# Altium project IPT-LXe.PrjPCB (part 2 of 2)

## Sheet FPGA.SchDoc
size 635 x 381 mm
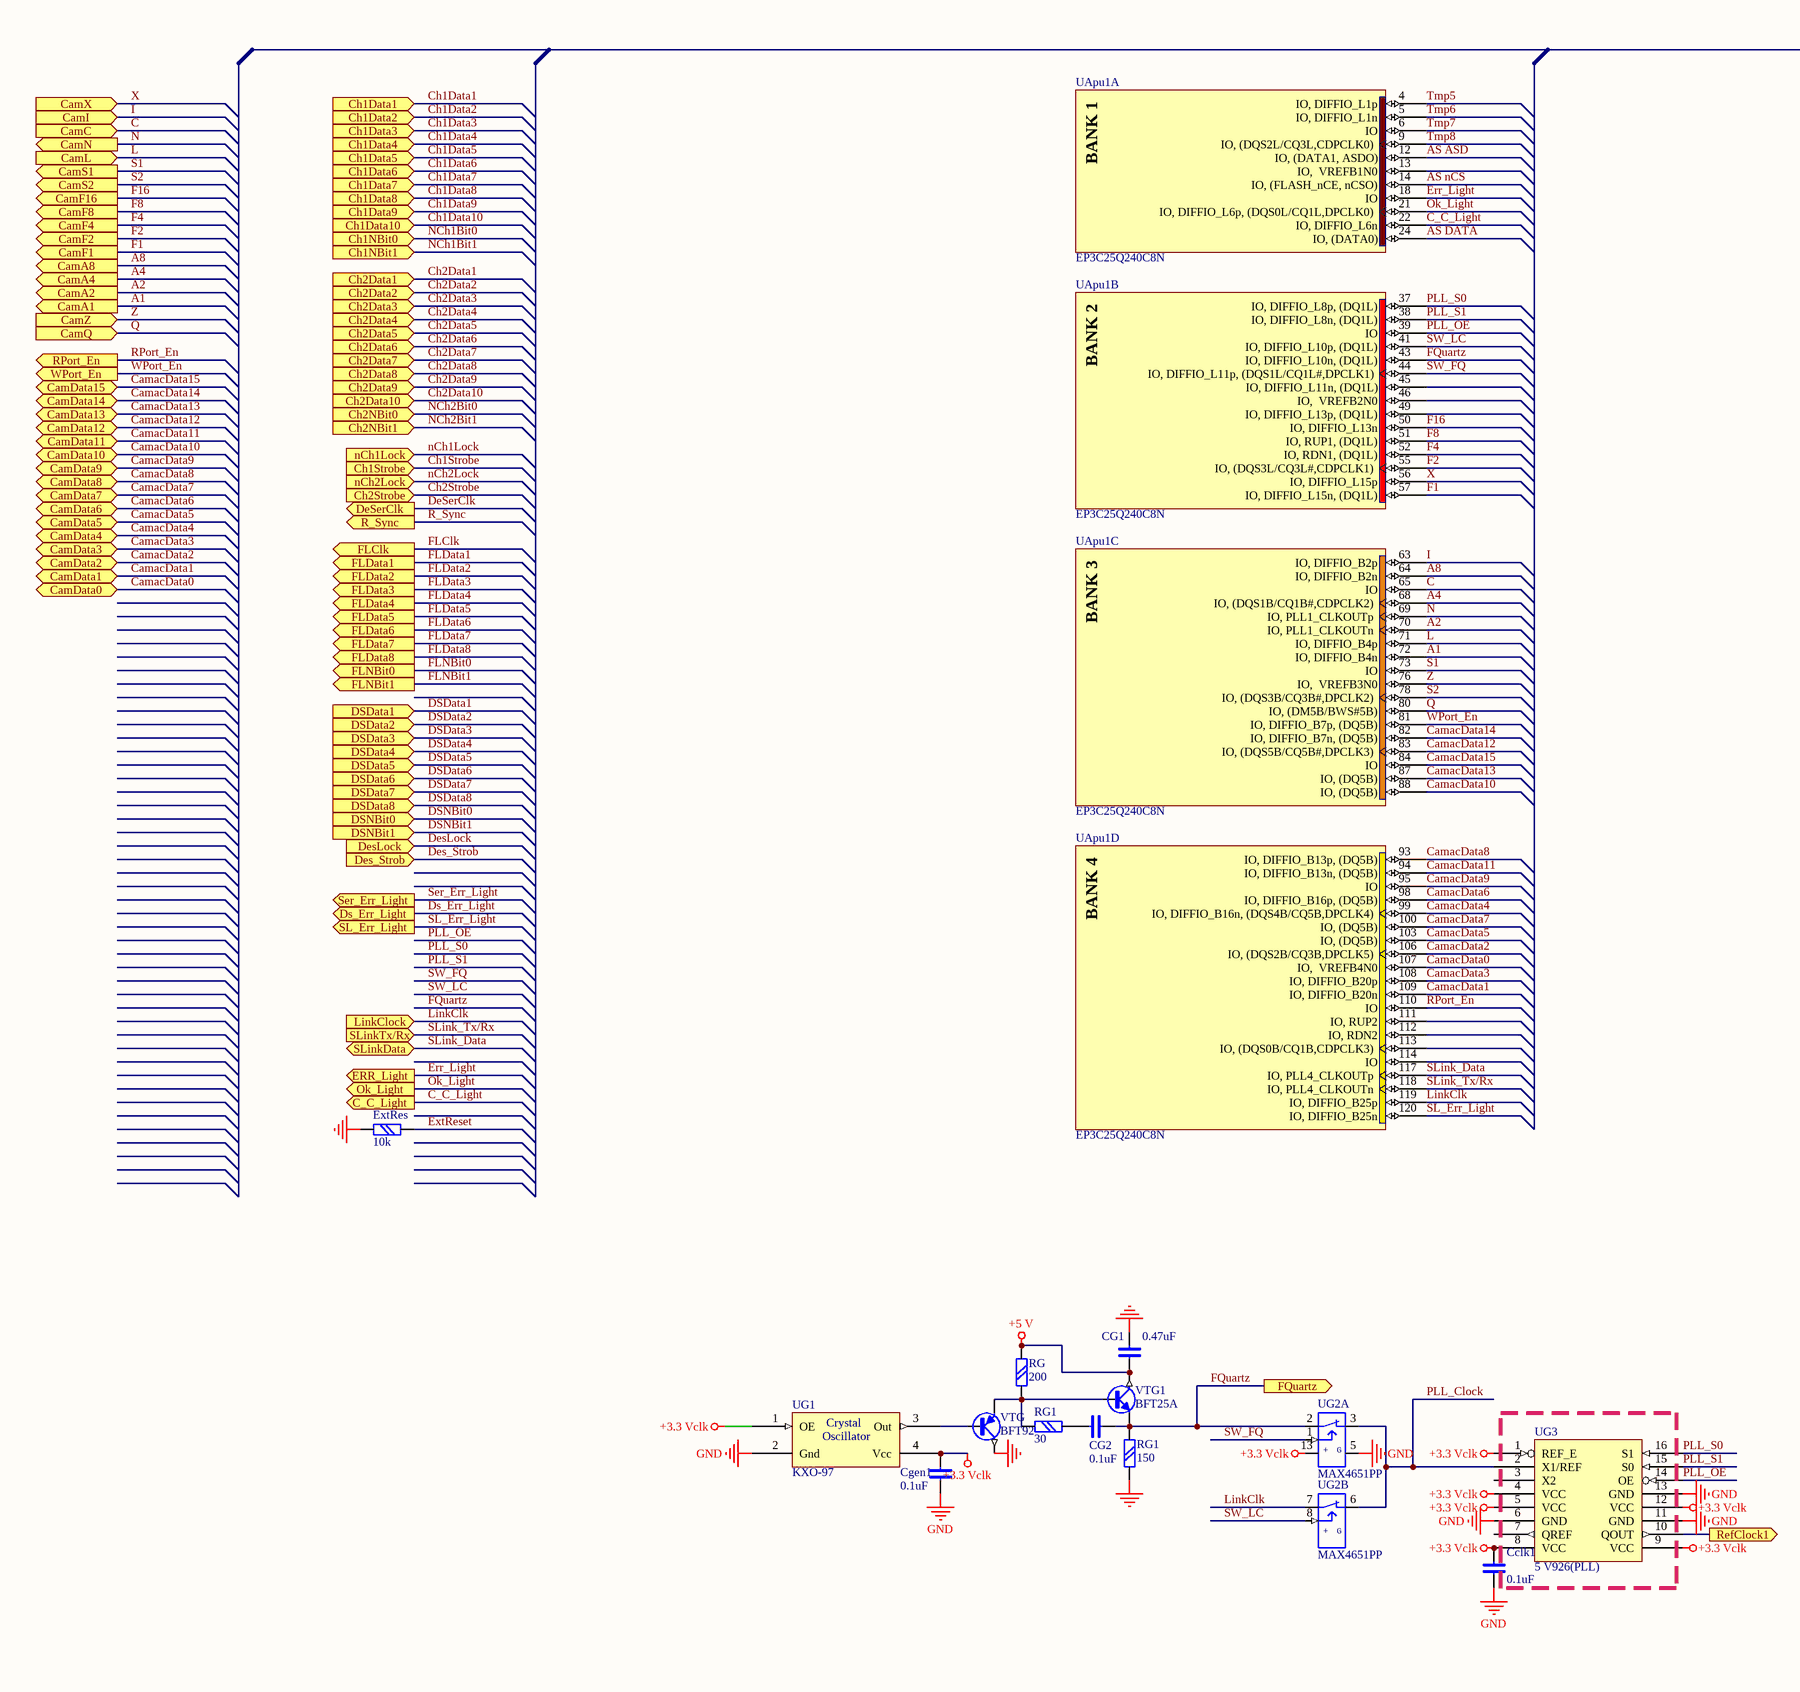
[diagram p5: FPGA.SchDoc, left]
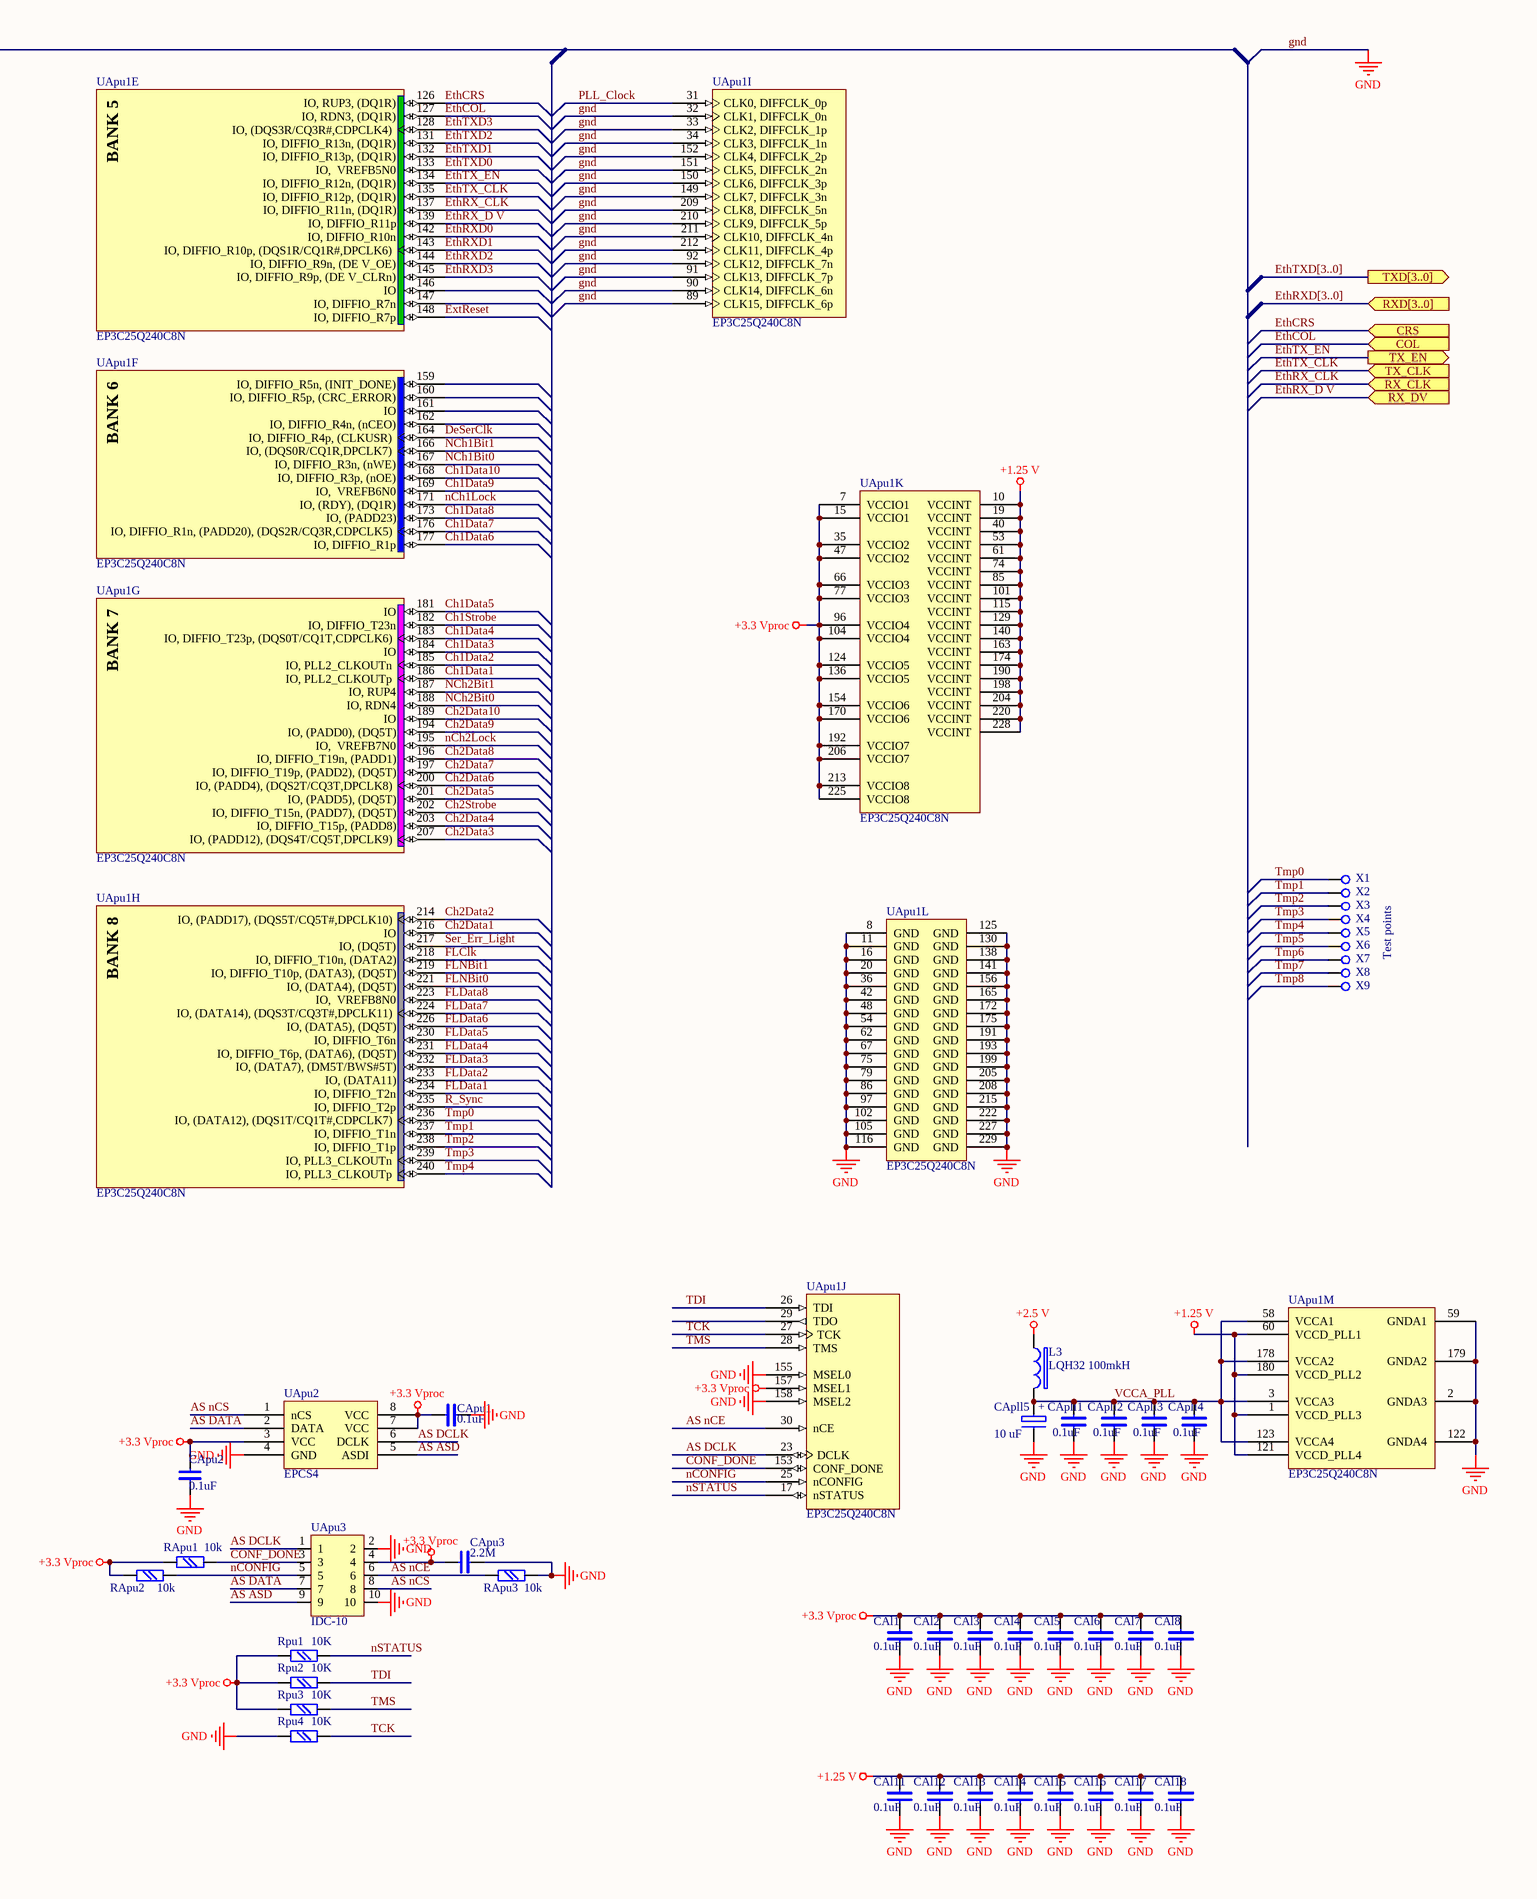
[diagram p6: FPGA.SchDoc, right]

### Parts
(Parts that share a designator on the sheet are numbered #1, #2 ... from top to bottom, then left to right.)
CAl1  0.1uF  [chip0805]
CAl2  0.1uF  [chip0805]
CAl3  0.1uF  [chip0805]
CAl4  0.1uF  [chip0805]
CAl5  0.1uF  [chip0805]
CAl6  0.1uF  [chip0805]
CAl7  0.1uF  [chip0805]
CAl8  0.1uF  [chip0805]
CAl11  0.1uF  [chip0805]
CAl12  0.1uF  [chip0805]
CAl13  0.1uF  [chip0805]
CAl14  0.1uF  [chip0805]
CAl15  0.1uF  [chip0805]
CAl16  0.1uF  [chip0805]
CAl17  0.1uF  [chip0805]
CAl18  0.1uF  [chip0805]
CApll1  0.1uF  [chip0805]
CApll2  0.1uF  [chip0805]
CApll3  0.1uF  [chip0805]
CApll4  0.1uF  [chip0805]
CApll5  10 uF  [CEL-SMD300]
CApu1  0.1uF  [chip0805]
CApu2  0.1uF  [chip0805]
CApu3  2.2M  [chip0805]
Cclk1  0.1uF  [chip0805]
CG1  0.47uF  [chip0805]
CG2  0.1uF  [chip0805]
Cgen1  0.1uF  [chip0805]
ExtRes  10k  [chip0805]
L3  LQH32 100mkH  [SDR0604]
RApu1  10k  [chip0805]
RApu2  10k  [chip0805]
RApu3  10k  [chip0805]
RG  200  [chip0805]
RG1#1  30  [chip0805]
RG1#2  150  [chip0805]
Rpu1  10K  [chip0805]
Rpu2  10K  [chip0805]
Rpu3  10K  [chip0805]
Rpu4  10K  [chip0805]
UApu1  EP3C25Q240C8N  [PQFP240_N]  (parts A,B,C,D,E,F,G,H,I,J,K,L,M of 13)
UApu2  EPCS4  [8SO200]
UApu3  IDC-10  [IDC-10MR]
UG1  KXO-97  [SG-636]
UG2  MAX4651PP  [16SOIC150]  (parts A,B of 4)
UG3  5 V926(PLL)  [TSSOP16]
VTG  BFT92  [SOT23_bt]
VTG1  BFT25A  [SOT23_bt]
X1  Tmp  [DRL06]  (value not drawn)
X2  Tmp  [DRL06]  (value not drawn)
X3  Tmp  [DRL06]  (value not drawn)
X4  Tmp  [DRL06]  (value not drawn)
X5  Tmp  [DRL06]  (value not drawn)
X6  Tmp  [DRL06]  (value not drawn)
X7  Tmp  [DRL06]  (value not drawn)
X8  Tmp  [DRL06]  (value not drawn)
X9  Tmp  [DRL06]  (value not drawn)

### Ports
C_C_Light (out), CamA1 (out), CamA2 (out), CamA4 (out), CamA8 (out), CamC (in), CamData0 (bidir), CamData1 (bidir), CamData2 (bidir), CamData3 (bidir), CamData4 (bidir), CamData5 (bidir), CamData6 (bidir), CamData7 (bidir), CamData8 (bidir), CamData9 (bidir), CamData10 (bidir), CamData11 (bidir), CamData12 (bidir), CamData13 (bidir), CamData14 (bidir), CamData15 (bidir), CamF1 (out), CamF2 (out), CamF4 (out), CamF8 (out), CamF16 (out), CamI (in), CamL (in), CamN (out), CamQ (in), CamS1 (out), CamS2 (out), CamX (in), CamZ (in), Ch1Data1 (in), Ch1Data2 (in), Ch1Data3 (in), Ch1Data4 (in), Ch1Data5 (in), Ch1Data6 (in), Ch1Data7 (in), Ch1Data8 (in), Ch1Data9 (in), Ch1Data10 (in), Ch1NBit0 (in), Ch1NBit1 (in), Ch1Strobe (in), Ch2Data1 (in), Ch2Data2 (in), Ch2Data3 (in), Ch2Data4 (in), Ch2Data5 (in), Ch2Data6 (in), Ch2Data7 (in), Ch2Data8 (in), Ch2Data9 (in), Ch2Data10 (in), Ch2NBit0 (in), Ch2NBit1 (in), Ch2Strobe (in), COL (in), CRS (in), Des_Strob (in), DeSerClk (out), DesLock (in), Ds_Err_Light (out), DSData1 (in), DSData2 (in), DSData3 (in), DSData4 (in), DSData5 (in), DSData6 (in), DSData7 (in), DSData8 (in), DSNBit0 (in), DSNBit1 (in), ERR_Light (out), FLClk (out), FLData1 (out), FLData2 (out), FLData3 (out), FLData4 (out), FLData5 (out), FLData6 (out), FLData7 (out), FLData8 (out), FLNBit0 (out), FLNBit1 (out), FQuartz (out), LinkClock (in), nCh1Lock (in), nCh2Lock (in), Ok_Light (out), R_Sync (out), RefClock1 (out), RPort_En (out), RX_CLK (in), RX_DV (in), RXD[3..0] (in), Ser_Err_Light (out), SL_Err_Light (out), SLinkData (bidir), SLinkTx/Rx (in), TX_CLK (in), TX_EN (out), TXD[3..0] (out), WPort_En (out)

### Nets
+1.25 V: CAl11.2 CAl12.2 CAl13.2 CAl14.2 CAl15.2 CAl16.2 CAl17.2 CAl18.2 UApu1.1(VCCD_PLL3) UApu1.10(VCCINT) UApu1.19(VCCINT) UApu1.40(VCCINT) UApu1.53(VCCINT) UApu1.60(VCCD_PLL1) UApu1.61(VCCINT) UApu1.74(VCCINT) UApu1.85(VCCINT) UApu1.101(VCCINT) UApu1.115(VCCINT) UApu1.121(VCCD_PLL4) UApu1.129(VCCINT) UApu1.140(VCCINT) UApu1.163(VCCINT) UApu1.174(VCCINT) UApu1.180(VCCD_PLL2) UApu1.190(VCCINT) UApu1.198(VCCINT) UApu1.204(VCCINT) UApu1.220(VCCINT) UApu1.228(VCCINT)
+2.5 V: L3.1
+3.3 Vclk: Cclk1.2 Cgen1.2 UG1.1(OE) UG1.4(Vcc) UG2.13(VCC) UG3.1(REF_E) UG3.4(VCC) UG3.5(VCC) UG3.8(VCC) UG3.9(VCC) UG3.12(VCC)
+3.3 Vproc: CAl1.2 CAl2.2 CAl3.2 CAl4.2 CAl5.2 CAl6.2 CAl7.2 CAl8.2 CApu1.2 CApu2.2 CApu3.1 RApu1.1 RApu2.1 Rpu1.1 Rpu2.1 Rpu3.1 UApu1.7(VCCIO1) UApu1.15(VCCIO1) UApu1.35(VCCIO2) UApu1.47(VCCIO2) UApu1.66(VCCIO3) UApu1.77(VCCIO3) UApu1.96(VCCIO4) UApu1.104(VCCIO4) UApu1.124(VCCIO5) UApu1.136(VCCIO5) UApu1.154(VCCIO6) UApu1.157(MSEL1) UApu1.170(VCCIO6) UApu1.192(VCCIO7) UApu1.206(VCCIO7) UApu1.213(VCCIO8) UApu1.225(VCCIO8) UApu2.3(VCC) UApu2.7(VCC) UApu2.8(VCC) UApu3.4
+5 V: CG1.2 RG.2 VTG1.COLL
DGND: CG1.1 ExtRes.1 RG1#2.1 VTG.COLL
gnd: CAl1.1 CAl2.1 CAl3.1 CAl4.1 CAl5.1 CAl6.1 CAl7.1 CAl8.1 CAl11.1 CAl12.1 CAl13.1 CAl14.1 CAl15.1 CAl16.1 CAl17.1 CAl18.1 CApll1.1 CApll2.1 CApll3.1 CApll4.1 CApll5.- CApu1.1 CApu2.1 CApu3.2 Cclk1.1 Cgen1.1 RApu3.2 Rpu4.1 UApu1.2(GNDA3) UApu1.8(GND) UApu1.11(GND) UApu1.16(GND) UApu1.20(GND) UApu1.32(CLK1,_DIFFCLK_0n) UApu1.33(CLK2,_DIFFCLK_1p) UApu1.34(CLK3,_DIFFCLK_1n) UApu1.36(GND) UApu1.42(GND) UApu1.48(GND) UApu1.54(GND) UApu1.59(GNDA1) UApu1.62(GND) UApu1.67(GND) UApu1.75(GND) UApu1.79(GND) UApu1.86(GND) UApu1.89(CLK15,_DIFFCLK_6p) UApu1.90(CLK14,_DIFFCLK_6n) UApu1.91(CLK13,_DIFFCLK_7p) UApu1.92(CLK12,_DIFFCLK_7n) UApu1.97(GND) UApu1.102(GND) UApu1.105(GND) UApu1.116(GND) UApu1.122(GNDA4) UApu1.125(GND) UApu1.130(GND) UApu1.138(GND) UApu1.141(GND) UApu1.149(CLK7,_DIFFCLK_3n) UApu1.150(CLK6,_DIFFCLK_3p) UApu1.151(CLK5,_DIFFCLK_2n) UApu1.152(CLK4,_DIFFCLK_2p) UApu1.155(MSEL0) UApu1.156(GND) UApu1.158(MSEL2) UApu1.165(GND) UApu1.172(GND) UApu1.175(GND) UApu1.179(GNDA2) UApu1.191(GND) UApu1.193(GND) UApu1.199(GND) UApu1.205(GND) UApu1.208(GND) UApu1.209(CLK8,_DIFFCLK_5n) UApu1.210(CLK9,_DIFFCLK_5p) UApu1.211(CLK10,_DIFFCLK_4n) UApu1.212(CLK11,_DIFFCLK_4p) UApu1.215(GND) UApu1.222(GND) UApu1.227(GND) UApu1.229(GND) UApu2.4(GND) UApu3.2 UApu3.10 UG1.2(Gnd) UG2.5(GND) UG3.6(GND) UG3.11(GND) UG3.13(GND)
A1: UApu1.72(IO,_DIFFIO_B4n) ; port CamA1
A2: UApu1.70(IO,_PLL1_CLKOUTn) ; port CamA2
A4: UApu1.68(IO,_(DQS1B/CQ1B#,CDPCLK2)) ; port CamA4
A8: UApu1.64(IO,_DIFFIO_B2n) ; port CamA8
AS ASD: UApu1.12(IO,_(DATA1,_ASDO)) UApu2.5(ASDI) UApu3.9
AS DATA: UApu1.24(IO,_(DATA0)) UApu2.2(DATA) UApu3.7
AS DCLK: UApu1.23(DCLK) UApu2.6(DCLK) UApu3.1
AS nCE: RApu3.1 UApu1.30(nCE) UApu3.6
AS nCS: UApu1.14(IO,_(FLASH_nCE,_nCSO)) UApu2.1(nCS) UApu3.8
C: UApu1.65(IO) ; port CamC
C_C_Light: UApu1.22(IO,_DIFFIO_L6n) ; port C_C_Light
CamacData0: UApu1.107(IO,__VREFB4N0) ; port CamData0  [project net Cam_Data0]
CamacData1: UApu1.109(IO,_DIFFIO_B20n) ; port CamData1  [project net Cam_Data1]
CamacData2: UApu1.106(IO,_(DQS2B/CQ3B,DPCLK5)) ; port CamData2  [project net Cam_Data2]
CamacData3: UApu1.108(IO,_DIFFIO_B20p) ; port CamData3  [project net Cam_Data3]
CamacData4: UApu1.99(IO,_DIFFIO_B16n,_(DQS4B/CQ5B,DPCLK4)) ; port CamData4  [project net Cam_Data4]
CamacData5: UApu1.103(IO,_(DQ5B)) ; port CamData5  [project net Cam_Data5]
CamacData6: UApu1.98(IO,_DIFFIO_B16p,_(DQ5B)) ; port CamData6  [project net Cam_Data6]
CamacData7: UApu1.100(IO,_(DQ5B)) ; port CamData7  [project net Cam_Data7]
CamacData8: UApu1.93(IO,_DIFFIO_B13p,_(DQ5B)) ; port CamData8  [project net Cam_Data8]
CamacData9: UApu1.95(IO) ; port CamData9  [project net Cam_Data9]
CamacData10: UApu1.88(IO,_(DQ5B)) ; port CamData10  [project net Cam_Data10]
CamacData11: UApu1.94(IO,_DIFFIO_B13n,_(DQ5B)) ; port CamData11  [project net Cam_Data11]
CamacData12: UApu1.83(IO,_(DQS5B/CQ5B#,DPCLK3)) ; port CamData12  [project net Cam_Data12]
CamacData13: UApu1.87(IO,_(DQ5B)) ; port CamData13  [project net Cam_Data13]
CamacData14: UApu1.82(IO,_DIFFIO_B7n,_(DQ5B)) ; port CamData14  [project net Cam_Data14]
CamacData15: UApu1.84(IO) ; port CamData15  [project net Cam_Data15]
Ch1Data1: UApu1.186(IO,_PLL2_CLKOUTp) ; port Ch1Data1
Ch1Data2: UApu1.185(IO,_PLL2_CLKOUTn) ; port Ch1Data2
Ch1Data3: UApu1.184(IO) ; port Ch1Data3
Ch1Data4: UApu1.183(IO,_DIFFIO_T23p,_(DQS0T/CQ1T,CDPCLK6)) ; port Ch1Data4
Ch1Data5: UApu1.181(IO) ; port Ch1Data5
Ch1Data6: UApu1.177(IO,_DIFFIO_R1p) ; port Ch1Data6
Ch1Data7: UApu1.176(IO,_DIFFIO_R1n,_(PADD20),_(DQS2R/CQ3R,CDPCLK5)) ; port Ch1Data7
Ch1Data8: UApu1.173(IO,_(PADD23)) ; port Ch1Data8
Ch1Data9: UApu1.169(IO,__VREFB6N0) ; port Ch1Data9
Ch1Data10: UApu1.168(IO,_DIFFIO_R3p,_(nOE)) ; port Ch1Data10
Ch1Strobe: UApu1.182(IO,_DIFFIO_T23n) ; port Ch1Strobe
Ch2Data1: UApu1.216(IO) ; port Ch2Data1
Ch2Data2: UApu1.214(IO,_(PADD17),_(DQS5T/CQ5T#,DPCLK10)) ; port Ch2Data2
Ch2Data3: UApu1.207(IO,_(PADD12),_(DQS4T/CQ5T,DPCLK9)) ; port Ch2Data3
Ch2Data4: UApu1.203(IO,_DIFFIO_T15p,_(PADD8)) ; port Ch2Data4
Ch2Data5: UApu1.201(IO,_(PADD5),_(DQ5T)) ; port Ch2Data5
Ch2Data6: UApu1.200(IO,_(PADD4),_(DQS2T/CQ3T,DPCLK8)) ; port Ch2Data6
Ch2Data7: UApu1.197(IO,_DIFFIO_T19p,_(PADD2),_(DQ5T)) ; port Ch2Data7
Ch2Data8: UApu1.196(IO,_DIFFIO_T19n,_(PADD1)) ; port Ch2Data8
Ch2Data9: UApu1.194(IO,_(PADD0),_(DQ5T)) ; port Ch2Data9
Ch2Data10: UApu1.189(IO) ; port Ch2Data10
Ch2Strobe: UApu1.202(IO,_DIFFIO_T15n,_(PADD7),_(DQ5T)) ; port Ch2Strobe
CONF_DONE: RApu1.2 UApu1.153(CONF_DONE) UApu3.3
DeSerClk: UApu1.164(IO,_DIFFIO_R4p,_(CLKUSR)) ; port DeSerClk
ERR_Light: UApu1.18(IO) ; port ERR_Light
EthCOL: UApu1.127(IO,_RDN3,_(DQ1R)) ; port COL  [project net COL]
EthCRS: UApu1.126(IO,_RUP3,_(DQ1R)) ; port CRS  [project net CRS]
EthRX_CLK: UApu1.137(IO,_DIFFIO_R11n,_(DQ1R)) ; port RX_CLK
EthRX_D V: UApu1.139(IO,_DIFFIO_R11p) ; port RX_DV
EthRXD0: UApu1.142(IO,_DIFFIO_R10n)
EthRXD1: UApu1.143(IO,_DIFFIO_R10p,_(DQS1R/CQ1R#,DPCLK6))
EthRXD2: UApu1.144(IO,_DIFFIO_R9n,_(DE_V_OE))
EthRXD3: UApu1.145(IO,_DIFFIO_R9p,_(DE_V_CLRn))
EthTX_CLK: UApu1.135(IO,_DIFFIO_R12p,_(DQ1R)) ; port TX_CLK
EthTX_EN: UApu1.134(IO,_DIFFIO_R12n,_(DQ1R)) ; port TX_EN
EthTXD0: UApu1.133(IO,__VREFB5N0)
EthTXD1: UApu1.132(IO,_DIFFIO_R13p,_(DQ1R))
EthTXD2: UApu1.131(IO,_DIFFIO_R13n,_(DQ1R))
EthTXD3: UApu1.128(IO,_(DQS3R/CQ3R#,CDPCLK4))
ExtReset: ExtRes.2 UApu1.148(IO,_DIFFIO_R7p)
F1: UApu1.57(IO,_DIFFIO_L15n,_(DQ1L)) ; port CamF1  [project net CamF1]
F2: UApu1.55(IO,_(DQS3L/CQ3L#,CDPCLK1)) ; port CamF2  [project net CamF2]
F4: UApu1.52(IO,_RDN1,_(DQ1L)) ; port CamF4  [project net CamF4]
F8: UApu1.51(IO,_RUP1,_(DQ1L)) ; port CamF8  [project net CamF8]
F16: UApu1.50(IO,_DIFFIO_L13n) ; port CamF16  [project net CamF16]
FLClk: UApu1.218(IO,_DIFFIO_T10n,_(DATA2)) ; port FLClk
FLData1: UApu1.234(IO,_DIFFIO_T2n) ; port FLData1
FLData2: UApu1.233(IO,_(DATA11)) ; port FLData2
FLData3: UApu1.232(IO,_(DATA7),_(DM5T/BWS#5T)) ; port FLData3
FLData4: UApu1.231(IO,_DIFFIO_T6p,_(DATA6),_(DQ5T)) ; port FLData4
FLData5: UApu1.230(IO,_DIFFIO_T6n) ; port FLData5
FLData6: UApu1.226(IO,_(DATA5),_(DQ5T)) ; port FLData6
FLData7: UApu1.224(IO,_(DATA14),_(DQS3T/CQ3T#,DPCLK11)) ; port FLData7
FLData8: UApu1.223(IO,__VREFB8N0) ; port FLData8
FLNBit0: UApu1.221(IO,_(DATA4),_(DQ5T)) ; port FLNBit0
FLNBit1: UApu1.219(IO,_DIFFIO_T10p,_(DATA3),_(DQ5T)) ; port FLNBit1
FQuartz: CG2.1 RG1#2.2 UApu1.43(IO,_DIFFIO_L10n,_(DQ1L)) UG2.2(IN) VTG1.EMIT ; port FQuartz
I: UApu1.63(IO,_DIFFIO_B2p) ; port CamI  [project net CamI]
L: UApu1.71(IO,_DIFFIO_B4p) ; port CamL  [project net CamL]
LinkClk: UApu1.119(IO,_DIFFIO_B25p) UG2.7(IN) ; port LinkClock
N: UApu1.69(IO,_PLL1_CLKOUTp) ; port CamN  [project net CamN]
NCh1Bit0: UApu1.167(IO,_DIFFIO_R3n,_(nWE)) ; port Ch1NBit0  [project net Ch1Data11]
NCh1Bit1: UApu1.166(IO,_(DQS0R/CQ1R,DPCLK7)) ; port Ch1NBit1  [project net Ch1Data12]
nCh1Lock: UApu1.171(IO,_(RDY),_(DQ1R)) ; port nCh1Lock
NCh2Bit0: UApu1.188(IO,_RDN4) ; port Ch2NBit0  [project net Ch2Data11]
NCh2Bit1: UApu1.187(IO,_RUP4) ; port Ch2NBit1  [project net Ch2Data12]
nCh2Lock: UApu1.195(IO,__VREFB7N0) ; port nCh2Lock
nCONFIG: RApu2.2 UApu1.25(nCONFIG) UApu3.5
nSTATUS: Rpu1.2 UApu1.17(nSTATUS)
Ok_Light: UApu1.21(IO,_DIFFIO_L6p,_(DQS0L/CQ1L,DPCLK0)) ; port Ok_Light
PLL_Clock: UApu1.31(CLK0,_DIFFCLK_0p) UG2.3(OUT) UG2.6(OUT) UG3.2(X1/REF)
PLL_OE: UApu1.39(IO) UG3.14(OE)
PLL_S0: UApu1.37(IO,_DIFFIO_L8p,_(DQ1L)) UG3.16(S1)
PLL_S1: UApu1.38(IO,_DIFFIO_L8n,_(DQ1L)) UG3.15(S0)
Q: UApu1.80(IO,_(DM5B/BWS#5B)) ; port CamQ  [project net CamQ]
R_Sync: UApu1.235(IO,_DIFFIO_T2p) ; port R_Sync
RefClock1: UG3.10(QOUT) ; port RefClock1
RPort_En: UApu1.110(IO) ; port RPort_En
S1: UApu1.73(IO) ; port CamS1  [project net CamS1]
S2: UApu1.78(IO,_(DQS3B/CQ3B#,DPCLK2)) ; port CamS2  [project net CamS2]
Ser_Err_Light: UApu1.217(IO,_(DQ5T)) ; port Ser_Err_Light
SL_Err_Light: UApu1.120(IO,_DIFFIO_B25n) ; port SL_Err_Light
SLink_Data: UApu1.117(IO,_PLL4_CLKOUTp) ; port SLinkData
SLink_Tx/Rx: UApu1.118(IO,_PLL4_CLKOUTn) ; port SLinkTx/Rx
SW_FQ: UApu1.44(IO,_DIFFIO_L11p,_(DQS1L/CQ1L#,DPCLK1)) UG2.1(CONTROL)
SW_LC: UApu1.41(IO,_DIFFIO_L10p,_(DQ1L)) UG2.8(CONTROL)
TCK: Rpu4.2 UApu1.27(TCK)
TDI: Rpu2.2 UApu1.26(TDI)
Tmp0: UApu1.236(IO,_(DATA12),_(DQS1T/CQ1T#,CDPCLK7)) X1.DRIL
Tmp1: UApu1.237(IO,_DIFFIO_T1n) X2.DRIL
Tmp2: UApu1.238(IO,_DIFFIO_T1p) X3.DRIL
Tmp3: UApu1.239(IO,_PLL3_CLKOUTn) X4.DRIL
Tmp4: UApu1.240(IO,_PLL3_CLKOUTp) X5.DRIL
Tmp5: UApu1.4(IO,_DIFFIO_L1p) X6.DRIL
Tmp6: UApu1.5(IO,_DIFFIO_L1n) X7.DRIL
Tmp7: UApu1.6(IO) X8.DRIL
Tmp8: UApu1.9(IO,_(DQS2L/CQ3L,CDPCLK0)) X9.DRIL
TMS: Rpu3.2 UApu1.28(TMS)
VCCA_PLL: CApll1.2 CApll2.2 CApll3.2 CApll4.2 CApll5.+ L3.2 UApu1.3(VCCA3) UApu1.58(VCCA1) UApu1.123(VCCA4) UApu1.178(VCCA2)
WPort_En: UApu1.81(IO,_DIFFIO_B7p,_(DQ5B)) ; port WPort_En
X: UApu1.56(IO,_DIFFIO_L15p) ; port CamX  [project net CamX]
Z: UApu1.76(IO,__VREFB3N0) ; port CamZ  [project net CamZ]
NetCG2_2: CG2.2 RG1#1.1
NetRG_1: RG.1 RG1#1.2 VTG.EMIT VTG1.BASE
NetUG1_3: UG1.3(Out) VTG.BASE

Not connected (* = marked no-connect by the designer): UApu1 13(IO,__VREFB1N0) 29(TDO) 45(IO,_DIFFIO_L11n,_(DQ1L)) 46(IO,__VREFB2N0) 49(IO,_DIFFIO_L13p,_(DQ1L)) 111(IO,_RUP2) 112(IO,_RDN2) 113(IO,_(DQS0B/CQ1B,CDPCLK3)) 114(IO) 146(IO) 147(IO,_DIFFIO_R7n) 159(IO,_DIFFIO_R5n,_(INIT_DONE)) 160(IO,_DIFFIO_R5p,_(CRC_ERROR)) 161(IO) 162(IO,_DIFFIO_R4n,_(nCEO)); UG3 3(X2) 7(QREF)

### Buses and harness runs
bus EthRXD[3..0] = port RXD[3..0]
bus EthTXD[3..0] = port TXD[3..0]

### Notes on the sheet
- Test points
- (in symbol EP3C25Q240C8N, part A) BANK 1
- (in symbol EP3C25Q240C8N, part B) BANK 2
- (in symbol EP3C25Q240C8N, part C) BANK 3
- (in symbol EP3C25Q240C8N, part D) BANK 4
- (in symbol EP3C25Q240C8N, part E) BANK 5
- (in symbol EP3C25Q240C8N, part F) BANK 6
- (in symbol EP3C25Q240C8N, part G) BANK 7
- (in symbol EP3C25Q240C8N, part H) BANK 8
- (in symbol MAX4651PP, part A) +; G
- (in symbol MAX4651PP, part B) +; G
- (in symbol SG-636) Crystal; Oscillator

### Library data of the parts
CAl1-CAl8 CAl11-CAl18 CApll1-CApll4 = C
CApll5 = C POL
CApu1-CApu3 Cclk1 CG1 CG2 Cgen1 = C: Text Field1: 20; Text Field2: 10
ExtRes RG RG1#1 RG1#2 = MLT: Text Field1: 20; Text Field2: 20
L3 = DR: Text Field1: 30; Text Field2: 10
RApu1-RApu3 Rpu1-Rpu4 = R: Text Field1: 20; Text Field2: 20
UApu1 = EP3C25Q240C8N: Cyclone III Family FPGA, 148 I/O Pins, 4 PLLs, 240-Pin PQFP, Speed Grade 8, Commercial Grade, Pb-Free; Published: 26-Feb-2007; DatasheetVersion: ver2.0, May-2008; PackageVersion: ver15.1, May-2008; PackageReference: PQFP240; Publisher: Altium Limited; PackageDescription: 240-Pin Plastic Quad Flat Pack (PQFP240) - Wire Bond; Code_JEDEC: MS-029-GA; ComponentLink1Description: Manufacturer Link; ComponentLink1URL: http://www.altera.com/; ComponentLink2Description: Handbook (7.86MB); ComponentLink2URL: http://www.altera.com/literature/hb/cyc3/cyclone3_handbook.pdf; ComponentLink3Description: Packaging Specification; ComponentLink3URL: http://www.altera.com/literature/ds/dspkg.pdf
UApu2 = EPCS1: Serial configuration device for Cyclone (Altera)
UApu3 = IDC-10: Text Field1: 40; Text Field2: 60
UG1 = SG-636: Crystal Oscillator (SMD)
UG2 = MAX4651PP: Text Field1: 20; Text Field2: 40
UG3 = 5V926(PLL)
VTG = $PNP: Text Field1: 10; Text Field2: 20
VTG1 = $NPN: Text Field1: 10; Text Field2: 20
X1-X9 = DRL

## Nets that join several sheets
+1.25 V: Ref&Supply Unit (Csup16.+ Csup17.1 Uref6.2 Uref6.4), FPGA (30 pins)
+2.5 V: Ref&Supply Unit (Csup13.+ Csup14.1 Uref5.2 Uref5.4), FPGA (L3.1)
+3.3 V: Ref&Supply Unit (Csup7.+ Csup8.1 Uref3.2 Uref3.4), In-Out (21 pins), IPT-LXe Top (43 pins)
+3.3 Vclk: Ref&Supply Unit (Csup10.+ Csup11.1 Uref4.2 Uref4.4), FPGA (11 pins)
+3.3 Vproc: Ref&Supply Unit (Csup4.+ Csup5.1 Uref2.2 Uref2.4), FPGA (37 pins)
+5 V: Main schem (CLED.1 VDLED6.ANOD VDLED7.ANOD VDLED8.ANOD), Ref&Supply Unit (Csup2.+ Csup18.1 Uref1.2 Uref1.4), In-Out (9 pins), IPT-LXe Top (C9.2 VDLED1.ANOD VDLED2.ANOD), FPGA (CG1.2 RG.2 VTG1.COLL)
+6V Sup: Ref&Supply Unit (10 pins), CAMAC_v2 (7 pins)
Cam +6v: Ref&Supply Unit (L2.1), CAMAC_v2 (J1.B42 L1.1)
gnd: Main schem (CLED.2 CLED1.2 CLED2.2 CLED3.2), Ref&Supply Unit (26 pins), In-Out (36 pins), CAMAC_v2 (16 pins), IPT-LXe Top (59 pins), FPGA (91 pins)
A1: CAMAC_v2 (Rc14.2), FPGA (UApu1.72)
A2: CAMAC_v2 (Rc12.2), FPGA (UApu1.70)
A4: CAMAC_v2 (Rc10.2), FPGA (UApu1.68)
A8: CAMAC_v2 (Rc8.2), FPGA (UApu1.64)
C: CAMAC_v2 (Rc9.1), FPGA (UApu1.65)
C_C_Light: Main schem (RLED1.2), FPGA (UApu1.22)
Cam_Data0: CAMAC_v2 (Ucam1.9 Ucam3.10), FPGA (UApu1.107)
Cam_Data1: CAMAC_v2 (Ucam2.9 Ucam4.10), FPGA (UApu1.109)
Cam_Data2: CAMAC_v2 (Ucam1.12 Ucam3.5), FPGA (UApu1.106)
Cam_Data3: CAMAC_v2 (Ucam2.12 Ucam4.5), FPGA (UApu1.108)
Cam_Data4: CAMAC_v2 (Ucam1.7 Ucam3.13), FPGA (UApu1.99)
Cam_Data5: CAMAC_v2 (Ucam2.7 Ucam4.13), FPGA (UApu1.103)
Cam_Data6: CAMAC_v2 (Ucam1.14 Ucam3.2), FPGA (UApu1.98)
Cam_Data7: CAMAC_v2 (Ucam2.14 Ucam4.2), FPGA (UApu1.100)
Cam_Data8: CAMAC_v2 (Ucam1.5 Ucam5.10), FPGA (UApu1.93)
Cam_Data9: CAMAC_v2 (Ucam2.5 Ucam6.10), FPGA (UApu1.95)
Cam_Data10: CAMAC_v2 (Ucam1.16 Ucam5.5), FPGA (UApu1.88)
Cam_Data11: CAMAC_v2 (Ucam2.16 Ucam6.5), FPGA (UApu1.94)
Cam_Data12: CAMAC_v2 (Ucam1.3 Ucam5.13), FPGA (UApu1.83)
Cam_Data13: CAMAC_v2 (Ucam2.3 Ucam6.13), FPGA (UApu1.87)
Cam_Data14: CAMAC_v2 (Ucam1.18 Ucam5.2), FPGA (UApu1.82)
Cam_Data15: CAMAC_v2 (Ucam2.18 Ucam6.2), FPGA (UApu1.84)
CamF1: CAMAC_v2 (Rc6.2), FPGA (UApu1.57)
CamF2: CAMAC_v2 (Rc4.2), FPGA (UApu1.55)
CamF4: CAMAC_v2 (Rc3.2), FPGA (UApu1.52)
CamF8: CAMAC_v2 (Rc2.2), FPGA (UApu1.51)
CamF16: CAMAC_v2 (Rc1.2), FPGA (UApu1.50)
CamI: CAMAC_v2 (Rc7.1), FPGA (UApu1.63)
CamL: CAMAC_v2 (Rc13.1), FPGA (UApu1.71)
CamN: CAMAC_v2 (Rc11.1), FPGA (UApu1.69)
CamQ: CAMAC_v2 (Rc18.2), FPGA (UApu1.80)
CamS1: CAMAC_v2 (Rc15.1), FPGA (UApu1.73)
CamS2: CAMAC_v2 (Rc17.1), FPGA (UApu1.78)
CamX: CAMAC_v2 (Rc5.1), FPGA (UApu1.56)
CamZ: CAMAC_v2 (Rc16.2), FPGA (UApu1.76)
Ch1Data1: IPT-LXe Top (UFL1.45), FPGA (UApu1.186)
Ch1Data2: IPT-LXe Top (UFL1.46), FPGA (UApu1.185)
Ch1Data3: IPT-LXe Top (UFL1.47), FPGA (UApu1.184)
Ch1Data4: IPT-LXe Top (UFL1.48), FPGA (UApu1.183)
Ch1Data5: IPT-LXe Top (UFL1.54), FPGA (UApu1.181)
Ch1Data6: IPT-LXe Top (UFL1.55), FPGA (UApu1.177)
Ch1Data7: IPT-LXe Top (UFL1.56), FPGA (UApu1.176)
Ch1Data8: IPT-LXe Top (UFL1.57), FPGA (UApu1.173)
Ch1Data9: IPT-LXe Top (UFL1.64), FPGA (UApu1.169)
Ch1Data10: IPT-LXe Top (UFL1.65), FPGA (UApu1.168)
Ch1Data11: IPT-LXe Top (UFL1.66), FPGA (UApu1.167)
Ch1Data12: IPT-LXe Top (UFL1.67), FPGA (UApu1.166)
Ch1Strobe: IPT-LXe Top (UFL1.49), FPGA (UApu1.182)
Ch2Data1: IPT-LXe Top (UFL2.45), FPGA (UApu1.216)
Ch2Data2: IPT-LXe Top (UFL2.46), FPGA (UApu1.214)
Ch2Data3: IPT-LXe Top (UFL2.47), FPGA (UApu1.207)
Ch2Data4: IPT-LXe Top (UFL2.48), FPGA (UApu1.203)
Ch2Data5: IPT-LXe Top (UFL2.54), FPGA (UApu1.201)
Ch2Data6: IPT-LXe Top (UFL2.55), FPGA (UApu1.200)
Ch2Data7: IPT-LXe Top (UFL2.56), FPGA (UApu1.197)
Ch2Data8: IPT-LXe Top (UFL2.57), FPGA (UApu1.196)
Ch2Data9: IPT-LXe Top (UFL2.64), FPGA (UApu1.194)
Ch2Data10: IPT-LXe Top (UFL2.65), FPGA (UApu1.189)
Ch2Data11: IPT-LXe Top (UFL2.66), FPGA (UApu1.188)
Ch2Data12: IPT-LXe Top (UFL2.67), FPGA (UApu1.187)
Ch2Strobe: IPT-LXe Top (UFL2.49), FPGA (UApu1.202)
DeSerClk: IPT-LXe Top (UFL1.4 UFL2.4), FPGA (UApu1.164)
ERR_Light: Main schem (RLED3.2), FPGA (UApu1.18)
FLClk: In-Out (Ds1.3 USer1.14), FPGA (UApu1.218)
FLData1: In-Out (USer1.3), FPGA (UApu1.234)
FLData2: In-Out (USer1.4), FPGA (UApu1.233)
FLData3: In-Out (USer1.5), FPGA (UApu1.232)
FLData4: In-Out (USer1.6), FPGA (UApu1.231)
FLData5: In-Out (USer1.7), FPGA (UApu1.230)
FLData6: In-Out (USer1.8), FPGA (UApu1.226)
FLData7: In-Out (USer1.9), FPGA (UApu1.224)
FLData8: In-Out (USer1.10), FPGA (UApu1.223)
FLNBit0: In-Out (USer1.11), FPGA (UApu1.221)
FLNBit1: In-Out (USer1.12), FPGA (UApu1.219)
LinkClk: In-Out (UL1.7), FPGA (UApu1.119 UG2.7)
nCh1Lock: IPT-LXe Top (R11.1 UFL1.63 USB_In1.7), FPGA (UApu1.171)
nCh2Lock: IPT-LXe Top (R12.1 UFL2.63 USB_In1.3), FPGA (UApu1.195)
Ok_Light: Main schem (RLED2.2), FPGA (UApu1.21)
R_Sync: In-Out (USer1.1 USer1.2), FPGA (UApu1.235)
RPort_En: CAMAC_v2 (16 pins), FPGA (UApu1.110)
Ser_Err_Light: In-Out (Rser4.1), FPGA (UApu1.217)
SL_Err_Light: In-Out (RSL9.1), FPGA (UApu1.120)
SLink_Data: In-Out (UL2.7), FPGA (UApu1.117)
SLink_Tx/Rx: In-Out (UL2.3 UL2.4), FPGA (UApu1.118)
WPort_En: CAMAC_v2 (Ucam1.1 Ucam1.19 Ucam2.1 Ucam2.19), FPGA (UApu1.81)